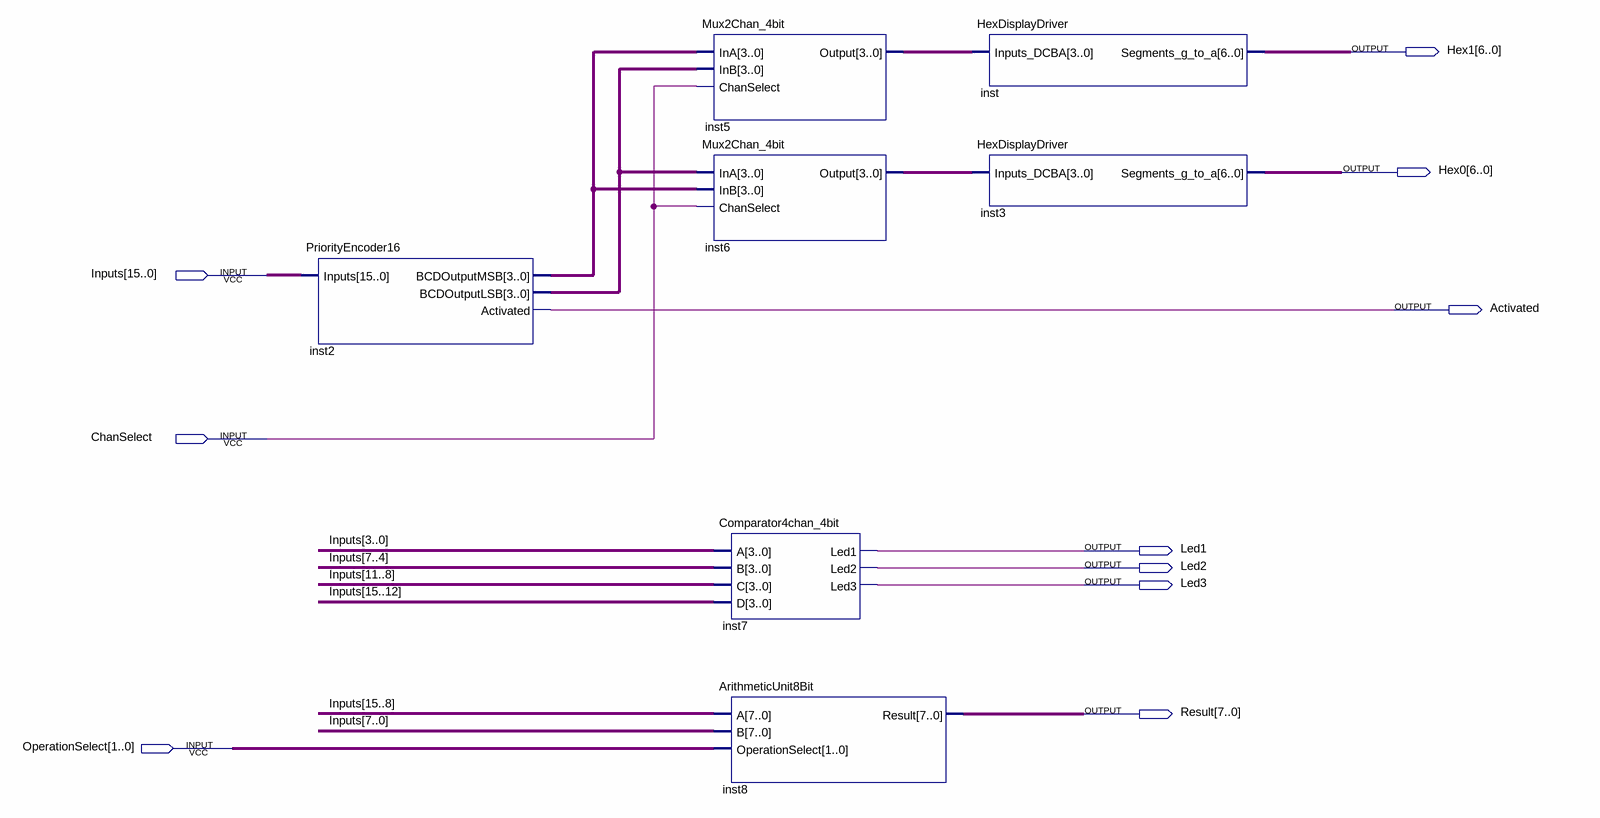
[diagram p0: schematic sheet]
// Quartus schematic HEXto7SegDecoder.bdf as structural Verilog: 7 symbols, 10 pins
module HEXto7SegDecoder (
  input  [15:0] Inputs,
  input  ChanSelect,
  input  [1:0] OperationSelect,
  output [6:0] Hex1,
  output [6:0] Hex0,
  output Activated,
  output Led1,
  output Led2,
  output Led3,
  output [7:0] Result
);

  wire [3:0] inst2_bcdoutputlsb, inst2_bcdoutputmsb, inst5_output, inst6_output;

  PriorityEncoder16 inst2 (
    .Inputs(Inputs), .BCDOutputMSB(inst2_bcdoutputmsb), .BCDOutputLSB(inst2_bcdoutputlsb),
    .Activated(Activated));
  Mux2Chan_4bit inst5 (
    .InA(inst2_bcdoutputmsb), .InB(inst2_bcdoutputlsb), .ChanSelect(ChanSelect), .Output(inst5_output));
  Mux2Chan_4bit inst6 (
    .InA(inst2_bcdoutputlsb), .InB(inst2_bcdoutputmsb), .ChanSelect(ChanSelect), .Output(inst6_output));
  Comparator4chan_4bit inst7 (
    .A(Inputs[3:0]), .B(Inputs[7:4]), .C(Inputs[11:8]), .D(Inputs[15:12]), .Led1(Led1), .Led2(Led2),
    .Led3(Led3));
  ArithmeticUnit8Bit inst8 (.A(Inputs[15:8]), .B(Inputs[7:0]), .OperationSelect(OperationSelect), .Result(Result));
  HexDisplayDriver inst (.Inputs_DCBA(inst5_output), .Segments_g_to_a(Hex1));
  HexDisplayDriver inst3 (.Inputs_DCBA(inst6_output), .Segments_g_to_a(Hex0));
endmodule
